# Altium schematic sheet RADG-Connector-S05-V00.SchDoc: RADG Connector (Logic Analyser Header, 60Pin 0.5mm FFC)
size A3; DrawnBy: Jonn Dillon; DocumentNumber: 4; SheetNumber: 3; SheetTotal: 6; Version: 00; Project: QUTMS RADIO GPS; PageSetup: Record=PageOptions|CenterHorizontal=True|CenterVertical=True|PrintScale=0.97|XCorrection=1.00|YCorrection=1.00|PrintKind=0|BorderSize=5000000|LeftOffset=0|BottomOffset=0|Orientation=2|PaperLength=1000|PaperWidth=1000|Scale=100|PaperSource=7|PrintQuality=-4|MediaType=1|DitherType=10|PaperKind=A4|PrintScaleMode=1
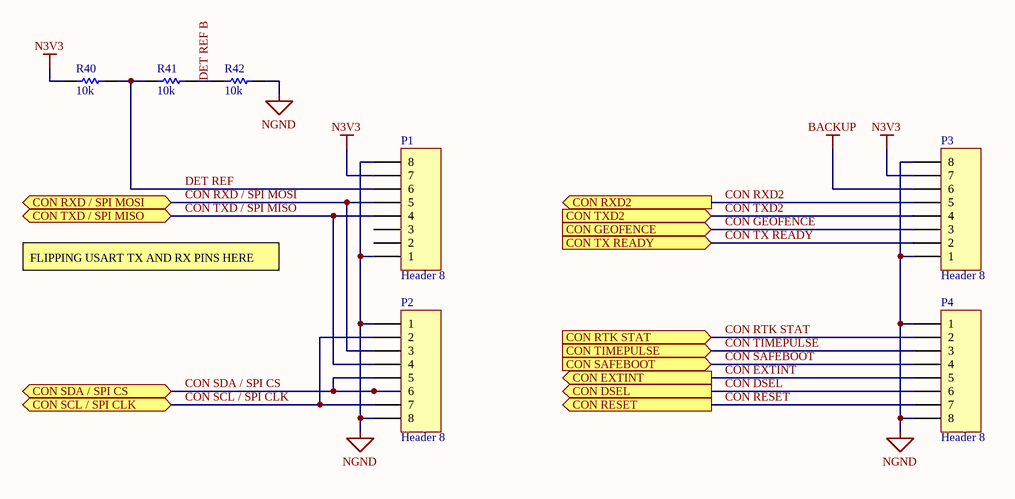
[diagram p0: RADG-Connector-S05-V00.SchDoc]

## Parts
P1  Header 8  [HDR1X8]
P2  Header 8  [HDR1X8]
P3  Header 8  [HDR1X8]
P4  Header 8  [HDR1X8]
R40  10k  [Res_ThinFilm_0603]
R41  10k  [Res_ThinFilm_0603]
R42  10k  [Res_ThinFilm_0603]

## Ports
CON DSEL (out), CON EXTINT (out), CON GEOFENCE (in), CON RESET (out), CON RTK STAT (in), CON RXD2 (out), CON RXD / SPI MOSI (bidir), CON SAFEBOOT (in), CON SCL / SPI CLK (bidir), CON SDA / SPI CS (bidir), CON TIMEPULSE (in), CON TX READY (in), CON TXD2 (in), CON TXD / SPI MISO (bidir)

## Nets
BACKUP: P3.6
N3V3: P1.7 P3.7 R40.1
NGND: P1.1 P1.8 P2.1 P2.8 P3.1 P3.8 P4.1 P4.8 R42.2
CON DSEL: P4.6 ; port CON DSEL
CON EXTINT: P4.5 ; port CON EXTINT
CON GEOFENCE: P3.3 ; port CON GEOFENCE
CON RESET: P4.7 ; port CON RESET
CON RTK STAT: P4.2 ; port CON RTK STAT
CON RXD2: P3.5 ; port CON RXD2
CON RXD / SPI MOSI: P1.5 P2.3 ; port CON RXD / SPI MOSI
CON SAFEBOOT: P4.4 ; port CON SAFEBOOT
CON SCL / SPI CLK: P2.2 P2.7 ; port CON SCL / SPI CLK
CON SDA / SPI CS: P2.5 P2.6 ; port CON SDA / SPI CS
CON TIMEPULSE: P4.3 ; port CON TIMEPULSE
CON TX READY: P3.2 ; port CON TX READY
CON TXD2: P3.4 ; port CON TXD2
CON TXD / SPI MISO: P1.4 P2.4 ; port CON TXD / SPI MISO
DET REF: P1.6 R40.2 R41.1
DET REF B: R41.2 R42.1

Not connected (* = marked no-connect by the designer): P1 2 3

## Notes on the sheet
- FLIPPING USART TX AND RX PINS HERE
- Revision History:
- Sheet Title:
- Rev
- Date
- Description
- Project:
- Size:
- Drawn By:
- A3
- Number:
- Revision:
- Sheet
- Version:
- of
- QUT Motorsport
- O-120, Gardens Point
- 2 George Street
- Brisbane, QLD 4000
- Australia
- Print Date:
- Print Time:
- File Name:

## Library data of the parts
P1-P4 = Header 8: Header, 8-Pin; LatestRevisionDate: 17-Jul-2002; LatestRevisionNote: Re-released for DXP Platform.; Publisher: Altium Limited
R40-R42 = 10k 5% 0603: Resistor, SMD, 10k, 0.1W, 5%, 0603